# EAGLE design SergeVCO (EAGLE 9.6.2)
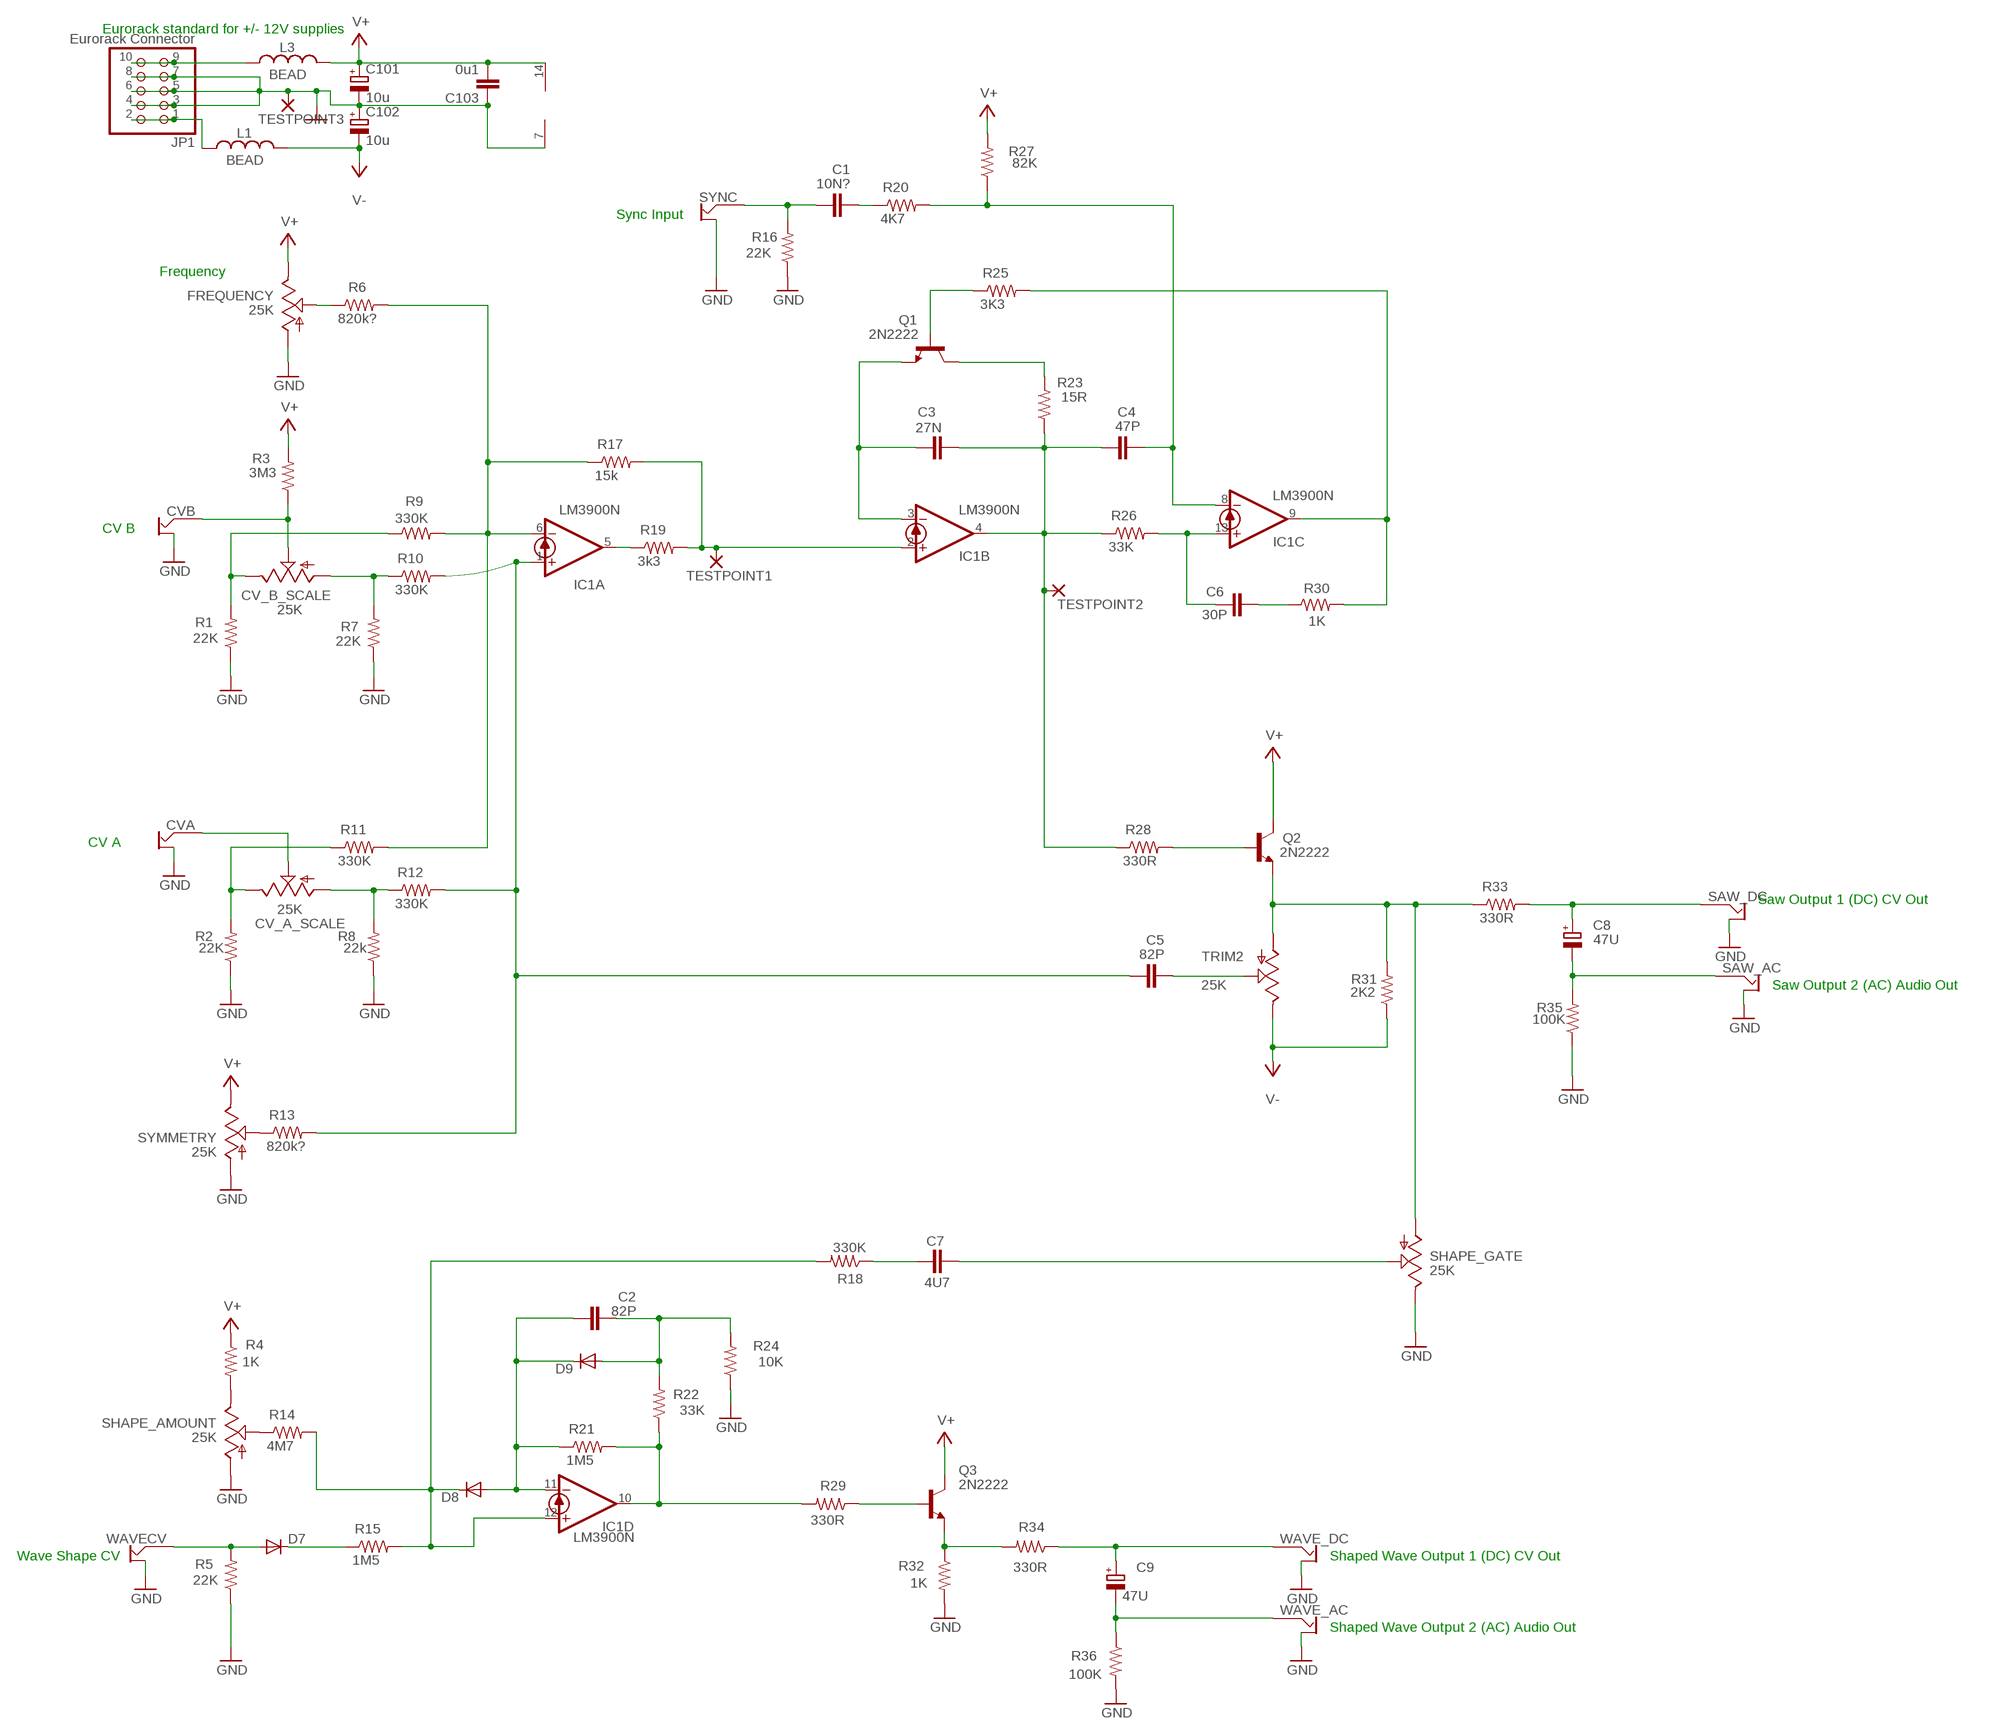
[diagram p0: schematic, sheet 1]

## Parts
C1  10N?  C-EU050-025X075-AARON  [C050-025X075-AARON]
C2  82P  C-EU050-025X075-AARON  [C050-025X075-AARON]
C3  27N  C-EU050-025X075-AARON  [C050-025X075-AARON]
C4  47P  C-EU050-025X075-AARON  [C050-025X075-AARON]
C5  82P  C-EU050-025X075-AARON  [C050-025X075-AARON]
C6  30P  C-EU050-025X075-AARON  [C050-025X075-AARON]
C7  4U7  C-EU050-025X075-AARON  [C050-025X075-AARON]
C8  47U  CPOL-EUE1.8-4  [E1,8-4]
C9  47U  CPOL-EUE1.8-4  [E1,8-4]
C101  10u  CPOL-EUE1.8-4  [E1,8-4]
C102  10u  CPOL-EUE1.8-4  [E1,8-4]
C103  0u1  C-EU050-025X075-AARON  [C050-025X075-AARON]
CV_A_SCALE  25K  TRIM_US-B64Y  [B64Y]
CV_B_SCALE  25K  TRIM_US-B64Y  [B64Y]
CVA  OFFBOARD2JACKALT_AARON  [OFFBOARD2JACKALT]
CVB  OFFBOARD2JACKALT_AARON  [OFFBOARD2JACKALT]
D7  SMALL_DIODEDO35-7  [DO35-7]
D8  SMALL_DIODEDO35-7  [DO35-7]
D9  SMALL_DIODEDO35-7  [DO35-7]
FREQUENCY  25K  TRIM_US-B64Y  [B64Y]
IC1  LM3900N  [DIL14]
JP1  Eurorack Connector  PINHD-2X5  [2X05]
L1  BEAD  L-US0207/10  [0207/10]
L3  BEAD  L-US0207/10  [0207/10]
Q1  2N2222  [TO92-EBC-OVAL]
Q2  2N2222  [TO92-EBC-OVAL]
Q3  2N2222  [TO92-EBC-OVAL]
R1  22K  R-US_0207/10  [0207/10]
R2  22K  R-US_0207/10  [0207/10]
R3  3M3  R-US_0207/10  [0207/10]
R4  1K  R-US_0207/10  [0207/10]
R5  22K  R-US_0207/10  [0207/10]
R6  820k?  R-US_0207/10  [0207/10]
R7  22K  R-US_0207/10  [0207/10]
R8  22k  R-US_0207/10  [0207/10]
R9  330K  R-US_0207/10  [0207/10]
R10  330K  R-US_0207/10  [0207/10]
R11  330K  R-US_0207/10  [0207/10]
R12  330K  R-US_0207/10  [0207/10]
R13  820k?  R-US_0207/10  [0207/10]
R14  4M7  R-US_0207/10  [0207/10]
R15  1M5  R-US_0207/10  [0207/10]
R16  22K  R-US_0207/10  [0207/10]
R17  15k  R-US_0207/10  [0207/10]
R18  330K  R-US_0207/10  [0207/10]
R19  3k3  R-US_0207/10  [0207/10]
R20  4K7  R-US_0207/10  [0207/10]
R21  1M5  R-US_0207/10  [0207/10]
R22  33K  R-US_0207/10  [0207/10]
R23  15R  R-US_0207/10  [0207/10]
R24  10K  R-US_0207/10  [0207/10]
R25  3K3  R-US_0207/10  [0207/10]
R26  33K  R-US_0207/10  [0207/10]
R27  82K  R-US_0207/10  [0207/10]
R28  330R  R-US_0207/10  [0207/10]
R29  330R  R-US_0207/10  [0207/10]
R30  1K  R-US_0207/10  [0207/10]
R31  2K2  R-US_0207/10  [0207/10]
R32  1K  R-US_0207/10  [0207/10]
R33  330R  R-US_0207/10  [0207/10]
R34  330R  R-US_0207/10  [0207/10]
R35  100K  R-US_0207/10  [0207/10]
R36  100K  R-US_0207/10  [0207/10]
SAW_AC  OFFBOARD2JACKALT_AARON  [OFFBOARD2JACKALT]
SAW_DC  OFFBOARD2JACKALT_AARON  [OFFBOARD2JACKALT]
SHAPE_AMOUNT  25K  TRIM_US-B64Y  [B64Y]
SHAPE_GATE  25K  TRIM_US-B64Y  [B64Y]
SYMMETRY  25K  TRIM_US-B64Y  [B64Y]
SYNC  OFFBOARD2JACKALT_AARON  [OFFBOARD2JACKALT]
TESTPOINT1  IOPAD_AARON  [ELLIPTICALPADSINGLE]
TESTPOINT2  IOPAD_AARON  [ELLIPTICALPADSINGLE]
TESTPOINT3  IOPAD_AARON  [ELLIPTICALPADSINGLE]
TRIM2  25K  TRIM_US-RS3  [RS3]
WAVE_AC  OFFBOARD2JACKALT_AARON  [OFFBOARD2JACKALT]
WAVE_DC  OFFBOARD2JACKALT_AARON  [OFFBOARD2JACKALT]
WAVECV  OFFBOARD2JACKALT_AARON  [OFFBOARD2JACKALT]

## Nets
GND: C101.- C102.+ C103.1 CVA.GND CVB.GND FREQUENCY.A IC1.7(P:GND) JP1.3 JP1.4 JP1.5 JP1.6 JP1.7 JP1.8 R1.1 R2.1 R5.1 R7.1 R8.1 R16.1 R24.1 R32.2 R35.1 R36.2 SAW_AC.GND SAW_DC.GND SHAPE_AMOUNT.A SHAPE_GATE.E SYMMETRY.A SYNC.GND TESTPOINT3.P$1(P) WAVE_AC.GND WAVE_DC.GND WAVECV.GND
N$1: FREQUENCY.S R6.1
N$2: CV_B_SCALE.S CVB.SIGNAL R3.1
N$3: CV_B_SCALE.E R1.2 R9.1
N$4: CV_B_SCALE.A R7.2 R10.1
N$5: R13.1 SYMMETRY.S
N$6: R4.2 SHAPE_AMOUNT.E
N$7: R14.1 SHAPE_AMOUNT.S
N$8: D7.A R5.2 WAVECV.SIGNAL
N$9: D7.C R15.1
N$10: CV_A_SCALE.S CVA.SIGNAL
N$11: CV_A_SCALE.E R2.2 R11.1
N$12: CV_A_SCALE.A R8.2 R12.1
N$13: C5.1 IC1.1(A:+IN) R10.2 R12.2 R13.2
N$14: IC1.6(A:-IN) R6.2 R9.2 R11.2 R17.1
N$15: C3.1 IC1.3(B:-IN) Q1.E
N$16: C2.1 D8.A D9.C IC1.11(D:-IN) R21.1
N$17: D8.C IC1.12(D:+IN) R14.2 R15.2 R18.2
N$18: IC1.10(D:OUT) R21.2 R22.1 R29.2
N$19: C2.2 D9.A R22.2 R24.2
N$20: C7.1 R18.1
N$21: C7.2 SHAPE_GATE.S
N$22: Q3.B R29.1
N$23: Q3.E R32.1 R34.2
N$24: C9.- R36.1 WAVE_AC.SIGNAL
N$25: C9.+ R34.1 WAVE_DC.SIGNAL
N$26: IC1.2(B:+IN) R17.2 R19.2 TESTPOINT1.P$1(P)
N$27: IC1.5(A:OUT) R19.1
N$28: C1.1 R16.2 SYNC.SIGNAL
N$29: C3.2 C4.1 IC1.4(B:OUT) R23.1 R26.1 R28.1 TESTPOINT2.P$1(P)
N$30: C1.2 R20.1
N$31: Q1.C R23.2
N$32: Q1.B R25.1
N$33: C6.1 IC1.13(C:+IN) R26.2
N$34: Q2.B R28.2
N$35: C4.2 IC1.8(C:-IN) R20.2 R27.1
N$36: C6.2 R30.1
N$37: IC1.9(C:OUT) R25.2 R30.2
N$38: C8.+ R33.2 SAW_DC.SIGNAL
N$39: Q2.E R31.2 R33.1 SHAPE_GATE.A TRIM2.A
N$40: C5.2 TRIM2.S
N$41: C8.- R35.2 SAW_AC.SIGNAL
N$42: JP1.1 JP1.2 L1.1
N$62: JP1.9 JP1.10 L3.1
V+: C101.+ C103.2 FREQUENCY.E IC1.14(P:V+) L3.2 Q2.C Q3.C R3.2 R4.1 R27.2 SYMMETRY.E
V-: C102.- L1.2 R31.1 TRIM2.E

## Notes on the sheet
- Eurorack standard for +/- 12V supplies
- Sync Input
- Frequency
- CV B
- CV A
- Saw Output 1 (DC) CV Out
- Saw Output 2 (AC) Audio Out
- Wave Shape CV | Shaped Wave Output 1 (DC) CV Out
- Shaped Wave Output 2 (AC) Audio Out

## Library data of the parts
C1-C7 C103 = aaroncaps:C-EU: CAPACITOR, European symbol
C8 C9 C101 C102 = rcl:CPOL-EU: POLARIZED CAPACITOR, European symbol
CV_A_SCALE CV_B_SCALE FREQUENCY SHAPE_AMOUNT SHAPE_GATE SYMMETRY TRIM2 = pot:TRIM_US-: POTENTIOMETER
CVA CVB SAW_AC SAW_DC SYNC WAVE_AC WAVE_DC WAVECV = aaronlibrary:OFFBOARD2JACKALT_AARON
D7-D9 = MusicThingModular:SMALL_DIODE: Small Signal Diode
IC1 = linear:LM3900: OP AMP
JP1 = pinhead:PINHD-2X5: PIN HEADER
L1 L3 = rcl:L-US: INDUCTOR, American symbol; SPICEPREFIX: L
Q1-Q3 = adafruit:2N2222: NPN TRANSISTOR Big oval pads
R1-R36 = rcl:R-US_: RESISTOR, American symbol
TESTPOINT1-TESTPOINT3 = aaronlibrary:IOPAD_AARON

## Board
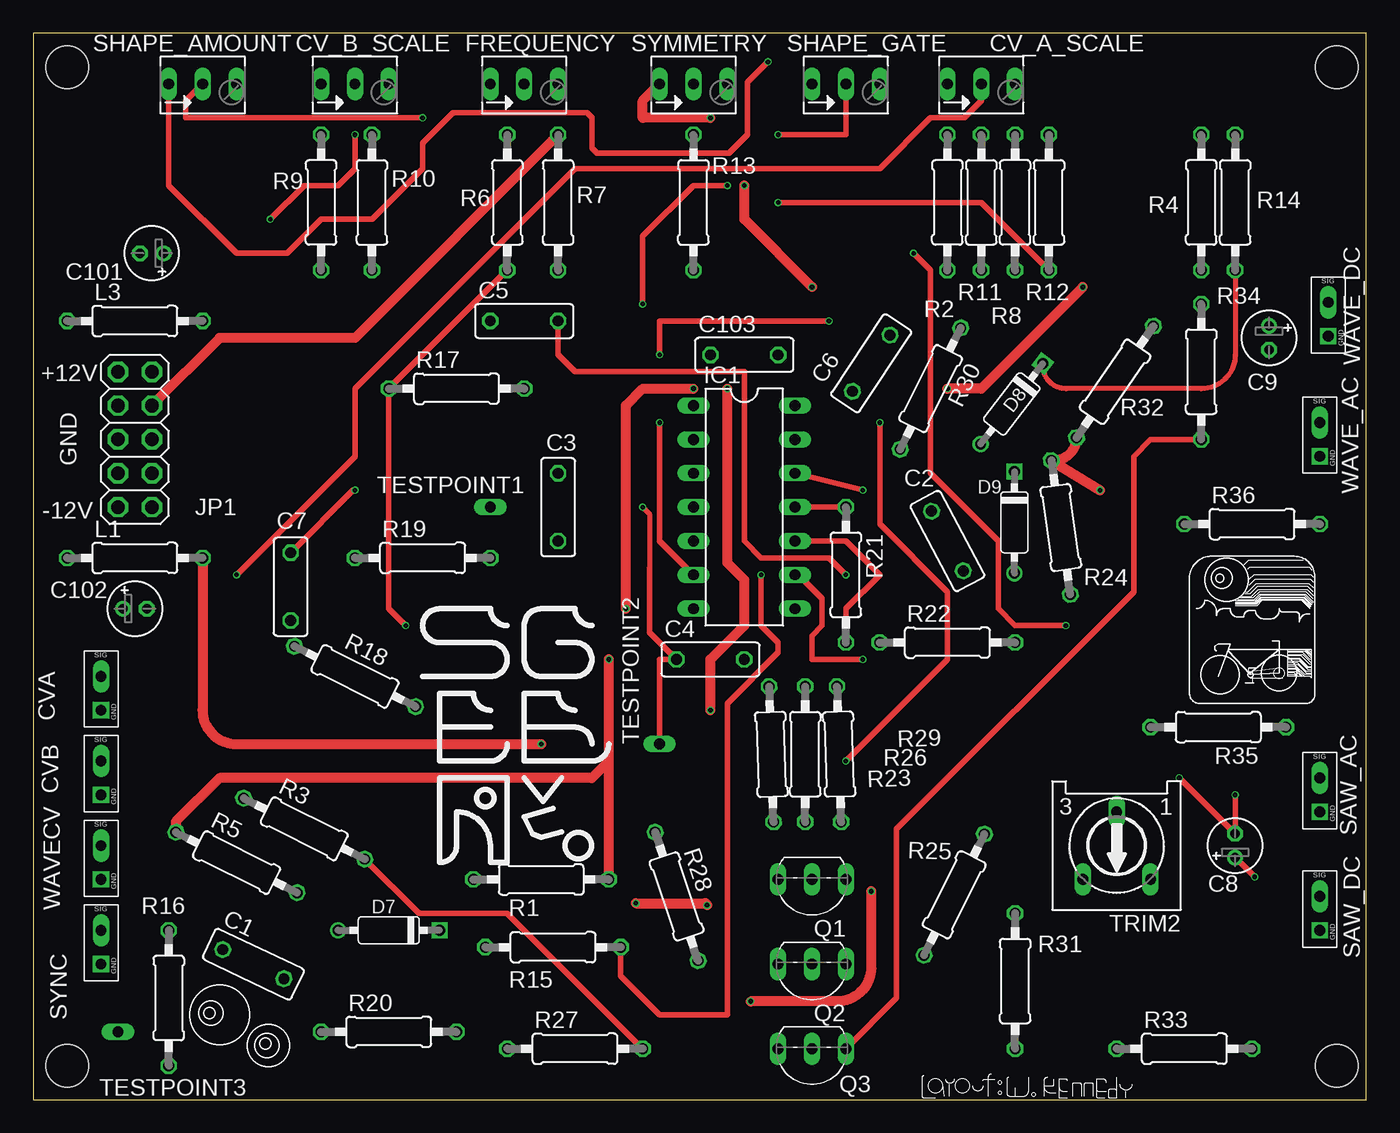
[diagram p1: board, top side]
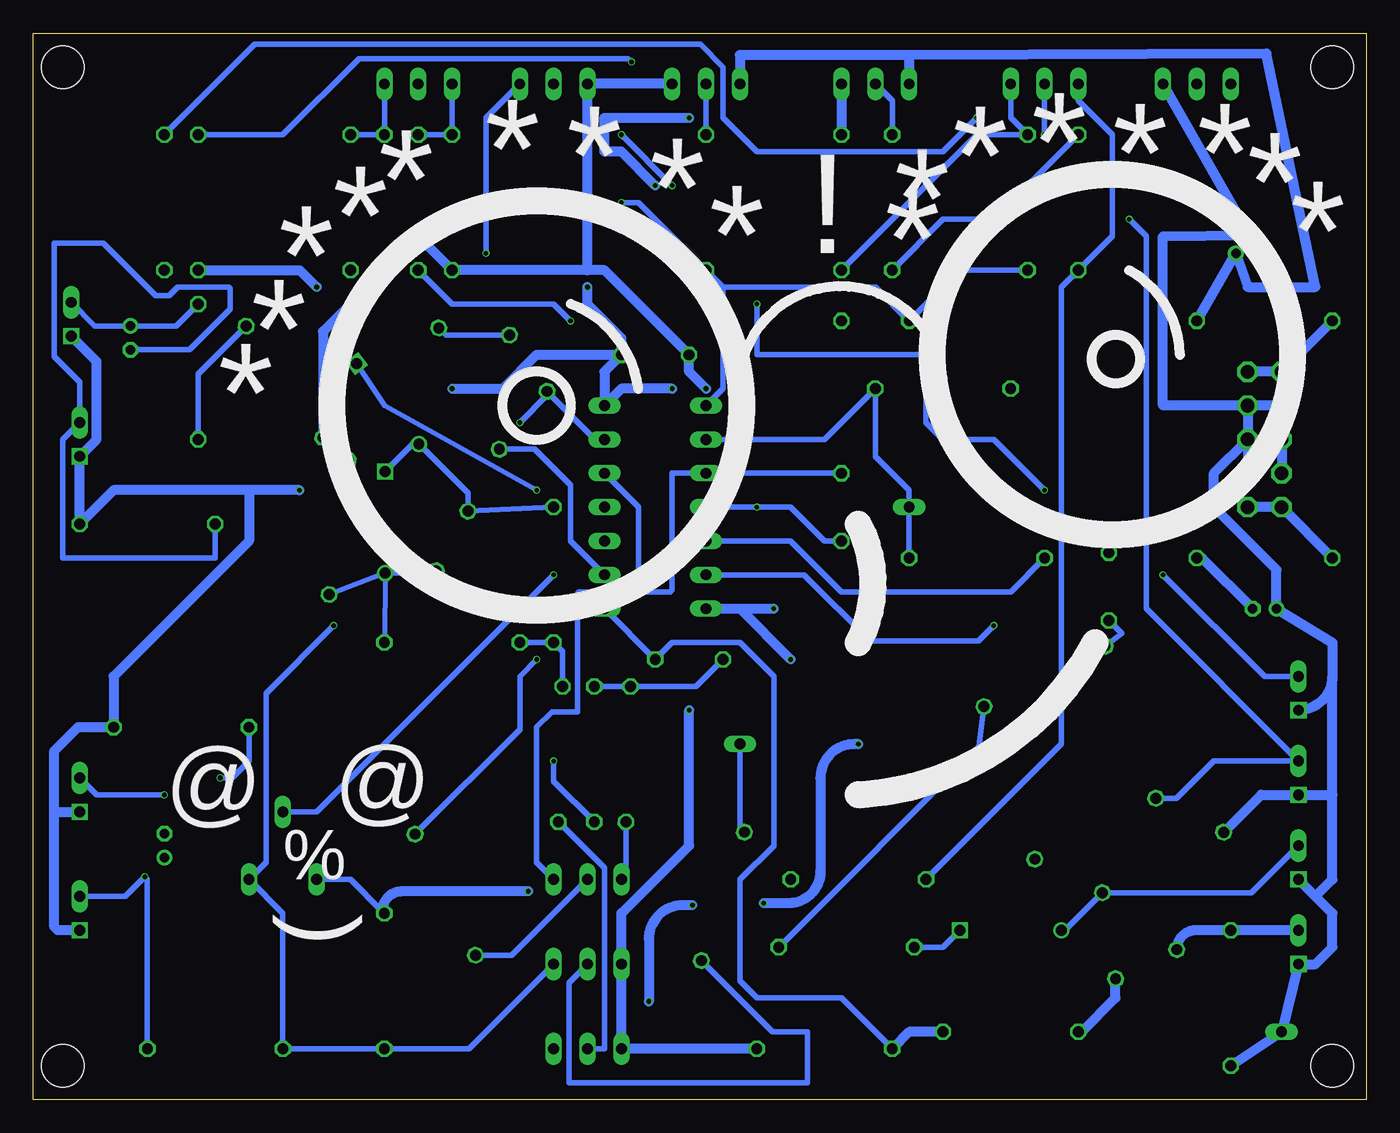
[diagram p2: board, bottom side, seen from below]

Size 100 x 80 mm. Coordinates in mm from the lower left corner, seen from the top.
Outline: 0,0 100,0 100,80 0,80 0,0
Copper layers (1*16): Top 0.035559375mm / dielectric 1.6mm / Bottom 0.035559375mm
Design rules "jlcpcb2layer (1) *": minimum track width 5mil, minimum drill 12mil, track to track 10mil, track to pad 10mil, pad to pad 10mil, via to via 10mil, smd to smd 5mil, copper to edge 8mil, drill to drill 6mil, minimum pad ring 5mil, minimum via ring 3mil, stop-mask expansion 2.5mil, vias tented up to drill 0mil, thermal gap 10mil
Holes 3.2 mm at 2.54,77.47 97.79,77.47 97.79,2.54 2.54,2.54

### Footprints (pad centres in the part's own frame; a part is rotated, then mirrored left to right if it is on the bottom)
C050-025X075-AARON = drill 0.813 octagon: 1 -2.54,0; 2 2.54,0
E1,8-4 = drill 0.711 pad 1.168: + -0.889,0 | drill 0.711 pad 1.168 octagon: - 0.889,0
B64Y = drill 0.813 long: A 2.54,0; E -2.54,0; S 0,0
OFFBOARD2JACKALT = drill 0.813 square: GND -1.27,-1.27 | drill 0.813 long: SIGNAL -1.27,1.27
DO35-7 = drill 0.813: A 3.81,0 | drill 0.813 square: C -3.81,0
DIL14 = drill 0.813 long: 1 -7.62,-3.81; 2 -5.08,-3.81; 3 -2.54,-3.81; 4 0,-3.81; 5 2.54,-3.81; 6 5.08,-3.81; 7 7.62,-3.81; 8 7.62,3.81; 9 5.08,3.81; 10 2.54,3.81; 11 0,3.81; 12 -2.54,3.81; 13 -5.08,3.81; 14 -7.62,3.81
2X05 = drill 1.016 octagon: 1 -5.08,-1.27; 2 -5.08,1.27; 3 -2.54,-1.27; 4 -2.54,1.27; 5 0,-1.27; 6 0,1.27; 7 2.54,-1.27; 8 2.54,1.27; 9 5.08,-1.27; 10 5.08,1.27
0207/10 = drill 0.813 octagon: 1 -5.08,0; 2 5.08,0
TO92-EBC-OVAL = drill 0.813 long: B 0,-1.27; C 2.54,-1.27; E -2.54,-1.27
ELLIPTICALPADSINGLE = drill 0.813 long: P$1 0,0
RS3 = drill 0.813 long: A -2.54,2.54; E 2.54,2.54; S 0,-2.54

### Placement (x,y rotation side)
C1  16.51,10.16 334.5 top
C2  68.58,41.91 298 top
C3  39.37,44.45 270 top
C4  50.8,33.02 0 top
C5  36.83,58.42 0 top
C6  62.87,55.24 56.3 top
C7  19.3,38.48 90 top
C8  90.17,19.05 90 top
C9  92.71,57.15 270 top
C101  8.89,63.5 180 top
C102  7.62,36.83 0 top
C103  53.34,55.88 0 top
CV_A_SCALE  71.12,76.2 0 top
CV_B_SCALE  24.13,76.2 0 top
CVA  6.35,30.48 0 top
CVB  6.35,24.13 0 top
D7  26.67,12.7 180 top
D8  73.41,52.2 232.2 top
D9  73.61,43.31 270 top
FREQUENCY  36.83,76.2 0 top
IC1  53.34,44.45 270 top
JP1  7.62,49.53 90 top
L1  7.62,40.64 0 top
L3  7.62,58.42 0 top
Q1  58.42,15.24 180 top
Q2  58.42,8.89 180 top
Q3  58.42,2.54 180 top
R1  38.1,16.51 180 top
R2  68.58,67.31 90 top
R3  20.32,20.32 333.3 top
R4  87.63,67.31 90 top
R5  15.24,17.78 333.5 top
R6  35.56,67.31 270 top
R7  39.37,67.31 270 top
R8  73.66,67.31 90 top
R9  21.59,67.31 90 top
R10  25.4,67.31 270 top
R11  71.12,67.31 270 top
R12  76.2,67.31 270 top
R13  49.53,67.31 270 top
R14  90.17,67.31 270 top
R15  38.99,11.43 0 top
R16  10.16,7.62 90 top
R17  31.75,53.34 0 top
R18  24.13,31.75 333.5 top
R19  29.21,40.64 0 top
R20  26.67,5.08 0 top
R21  60.96,39.37 270 top
R22  68.58,34.29 0 top
R23  55.37,25.91 271.9 top
R24  77.09,42.93 278 top
R25  69.09,15.37 63.5 top
R26  57.91,25.91 270 top
R27  40.64,3.81 0 top
R28  48.26,15.24 288.5 top
R29  60.45,25.91 91.8 top
R30  67.31,53.34 243.5 top
R31  73.66,8.89 270 top
R32  81.15,53.85 235.4 top
R33  86.36,3.81 0 top
R34  87.63,54.61 270 top
R35  88.9,27.94 180 top
R36  91.44,43.18 0 top
SAW_AC  97.79,22.86 0 top
SAW_DC  97.79,13.97 0 top
SHAPE_AMOUNT  12.7,76.2 0 top
SHAPE_GATE  60.96,76.2 0 top
SYMMETRY  49.53,76.2 0 top
SYNC  6.35,11.43 0 top
TESTPOINT1  34.29,44.45 0 top
TESTPOINT2  46.99,26.67 0 top
TESTPOINT3  6.35,5.08 0 top
TRIM2  81.28,19.05 180 top
WAVE_AC  97.79,49.53 0 top
WAVE_DC  98.42,58.55 0 top
WAVECV  6.35,17.78 0 top

### Tracks (layer width: path | path; a pad name or v marks a point on that pad's centre or on a via)
GND  (via drill 0.35)
  Top 0.762: v80.03,45.72 R24.1 76.56,47.96 arc90 R32.2 | R1.1 43.18,25.4 | 43.18,25.4 v43.18,33.02 | 43.18,25.4 41.91,24.13 13.97,24.13 10.69,20.85 R5.1 | v44.45,36.83 44.45,52.07 45.72,53.34 v49.53,53.34 | R7.1 24.13,57.15 13.97,57.15 JP1.7
  Bottom 0.762: C101.- 8.77,64.84 | 8.77,64.84 SHAPE_AMOUNT.A | JP1.7 JP1.5 | JP1.5 JP1.3 | JP1.7 JP1.8 JP1.4 JP1.6 | 2.54,31.75 2.54,34.29 C102.+ 6.73,39.75 11.43,44.45 11.43,46.99 JP1.5 | 2.54,31.75 arc90 CVA.GND | R5.1 7.88,22.86 CVB.GND 2.54,22.86 | R16.1 TESTPOINT3.P$1 SYNC.GND 3.81,10.16 2.54,11.43 2.54,13.97 3.81,15.24 | JP1.7 15.24,52.07 15.24,64.77 8.77,64.84 | FREQUENCY.A R7.1 | SYMMETRY.A SHAPE_GATE.E 58.42,62.23 | R32.2 78.27,57.62 R8.1 71.12,64.77 R2.1 58.42,62.23 | v80.03,45.72 83.82,45.72 | 83.82,45.72 93.98,45.72 R36.2 WAVE_AC.GND 95.25,49.53 95.25,55.37 WAVE_DC.GND | 58.42,62.23 57.15,62.23 C103.1 50.8,54.61 v49.53,53.34 | SAW_DC.GND 98.17,12.7 98.42,12.95 98.42,21.46 | 98.42,21.46 98.3,21.59 SAW_AC.GND | 98.42,21.46 98.42,26.16 96.65,27.94 R35.1 93.98,31.75 83.82,41.91 83.82,45.72 | v43.18,33.02 46.99,36.83 | IC1.7 46.99,36.83 | 3.81,15.24 WAVECV.GND | 3.81,15.24 2.54,16.51 2.54,22.86 | 2.54,22.86 2.54,31.75 | 46.99,36.83 v44.45,36.83
N$1
  Bottom 0.406: R6.1 35.56,74.93 FREQUENCY.S
N$2  (via drill 0.35)
  Top 0.406: v17.78,66.04 20.32,68.58 22.86,68.58 24.13,69.85 v24.13,72.39
  Bottom 0.406: R3.1 14.23,22.6 11.43,25.4 CVB.SIGNAL 16.51,36.83 16.51,64.77 v17.78,66.04 | v24.13,72.39 CV_B_SCALE.S
N$3
  Bottom 0.406: CV_B_SCALE.E 21.59,74.93 19.05,72.39 19.05,64.77 R9.1 22.86,60.96 22.86,26.67 R1.2
N$4
  Bottom 0.406: CV_B_SCALE.A 26.67,73.66 R10.1 29.21,72.39 R7.2
N$5
  Bottom 0.406: R13.1 SYMMETRY.S
N$6  (via drill 0.35)
  Top 0.406: v55.12,77.85 53.59,76.33 53.59,72.39 52.2,70.99 42.29,70.99 41.91,71.37 41.91,73.66 41.53,74.04 31.5,74.04 29.21,71.75 29.21,69.85 25.4,66.04 21.59,66.04 19.05,63.5 15.24,63.5 10.16,68.58 SHAPE_AMOUNT.E
  Bottom 0.406: R4.2 81.28,72.39 75.56,78.11 55.37,78.11 v55.12,77.85
N$7  (via drill 0.35)
  Top 0.406: v29.21,73.66 11.43,73.66 11.43,74.93 SHAPE_AMOUNT.S
  Bottom 0.406: R14.1 83.39,79.17 49.96,79.17 48.26,77.47 48.26,73.66 45.72,71.12 31.75,71.12 v29.21,73.66
N$8
  Bottom 0.406: D7.A 22.6,12.7 R5.2 8.62,15.51 WAVECV.SIGNAL
N$9
  Bottom 0.406: D7.C 31.75,11.43 R15.1
N$10  (via drill 0.35)
  Top 0.406: v15.24,39.37 24.13,48.26 24.13,53.34 40.64,69.85 63.5,69.85 67.31,73.66 69.85,73.66 71.12,74.93 CV_A_SCALE.S
  Bottom 0.406: v15.24,39.37 7.62,31.75 CVA.SIGNAL
N$11
  Bottom 0.406: CV_A_SCALE.E R2.2 R11.1
N$12
  Bottom 0.406: CV_A_SCALE.A R8.2 R12.1
N$13  (via drill 0.35)
  Top 0.406: v55.88,67.31 71.12,67.31 R12.2
  Bottom 0.406: R10.2 30.48,62.23 C5.1 36.83,60.96 48.26,60.96 | IC1.1 48.26,53.34 48.26,60.96 | 48.26,60.96 R13.2 54.61,67.31 v55.88,67.31
N$14  (via drill 0.35)
  Top 0.406: v27.94,35.56 26.67,36.83 R17.1 R6.2 | v59.69,58.42 46.99,58.42 v46.99,55.88 | v46.99,50.8 46.99,41.91 IC1.6
  Bottom 0.406: R9.2 27.94,66.04 31.75,66.04 R6.2 | R11.2 68.58,59.69 60.96,59.69 v59.69,58.42 | v27.94,35.56 29.08,34.42 37.21,34.42 42.16,39.37 IC1.6 | v46.99,55.88 v46.99,50.8
N$15
  Bottom 0.406: C3.1 IC1.3 52.07,46.99 52.07,38.23 52.2,38.1 59.05,38.1 59.18,37.97 59.18,29.08 61.09,29.08 62.23,27.94 62.23,17.78 Q1.E
N$16
  Top 0.406: R21.1 IC1.11
  Bottom 0.406: D9.C 71.54,49.19 D8.A 67.39,45.5 C2.1 R21.1
N$17  (via drill 0.35)
  Top 0.381: R14.2 90.17,55.88 arc-90 87.63,53.34 77.47,53.34 arc-90 75.74,55.07 D8.C
  Top 0.406: v62.23,45.72 IC1.12 | v54.61,39.37 54.61,35.56 55.88,34.29 55.88,33.53 52.07,29.72 52.07,6.35 46.99,6.35 44.07,9.27 R15.2
  Bottom 0.406: D8.C 73.66,52.07 v62.23,45.72 | IC1.12 54.61,44.45 v54.61,39.37 | R15.2 29.04,26.46 R18.2
N$18
  Top 0.406: R21.2 60.96,36.83 63.5,39.37 60.96,41.91 IC1.10
  Bottom 0.406: R29.2 60.29,33.62 R21.2 R22.1
N$19
  Bottom 0.381: R24.2 D9.A R22.2
  Bottom 0.406: D9.A 69.94,39.5 C2.2
N$20
  Bottom 0.406: C7.1 18.32,34.96 R18.1
N$21  (via drill 0.35)
  Top 0.406: C7.2 24,45.72 v24.13,45.72 | v45.72,59.69 45.72,64.77 49.53,68.58 v52.07,68.58 | v55.88,72.39 60.96,72.39 SHAPE_GATE.S
  Bottom 0.406: v24.13,45.72 27.94,49.53 31.75,49.53 33.02,50.8 33.02,55.88 45.72,55.88 v45.72,59.69 | v52.07,68.58 v55.88,72.39
N$22
  Bottom 0.406: R29.1 57.15,17.37 57.15,3.81 Q3.B
N$23
  Top 0.406: Q3.E 64.77,7.62 64.77,20.32 82.55,38.1 82.55,48.26 83.82,49.53 R34.2
  Bottom 0.406: R32.1 87.63,54.44 R34.2
N$24
  Bottom 0.406: C9.- 88.27,56.26 85.22,59.31 85.22,60.83 85.34,60.96 89.15,60.96 89.79,60.33 90.81,60.33 94.74,64.26 98.42,64.26 98.42,55.75 96.52,53.85 WAVE_AC.SIGNAL 97.79,49.53 97.79,40.64 86.36,40.64 R36.1
N$25
  Bottom 0.406: WAVE_DC.SIGNAL 95.38,58.04 C9.+ 89.28,58.04 R34.1
N$26
  Bottom 0.406: R19.2 TESTPOINT1.P$1 34.29,45.72 36.83,48.26 R17.2 40.64,49.53 IC1.2
N$27
  Bottom 0.406: R19.1 26.67,38.1 39.37,38.1 43.18,41.91 IC1.5
N$28
  Bottom 0.762: SYNC.SIGNAL R16.2 12.77,12.7 arc-90 C1.1
N$29  (via drill 0.35)
  Top 0.381: v45.72,44.45 46.23,43.94 46.23,39.88
  Top 0.406: 46.23,39.88 46.23,35.05 C4.1 46.99,33.02 TESTPOINT2.P$1
  Bottom 0.406: C3.2 40.64,41.91 43.18,44.45 v45.72,44.45 IC1.4 | R26.1 R23.1 50.3,30.98 C4.1 | TESTPOINT2.P$1 46.99,20.4 R28.1
N$30
  Bottom 0.762: C1.2 18.8,7.62 21.34,5.08 R20.1
N$31
  Bottom 0.406: R23.2 55.54,16.85 Q1.C
N$32
  Bottom 0.406: R25.1 64.11,10.82 Q1.B
N$33  (via drill 0.35)
  Top 0.406: v60.96,25.4 68.58,33.02 68.58,38.1 63.5,43.18 v63.5,50.8
  Bottom 0.406: IC1.13 57.85,49.53 C6.1 61.46,52.84 v63.5,50.8 | R26.2 60.96,23.88 v60.96,25.4
N$34
  Bottom 0.406: R28.2 44.53,5.08 41.91,5.08 41.91,1.27 59.82,1.27 59.82,8.76 Q2.B
N$35
  Bottom 0.406: IC1.8 C4.2 52.07,34.29 46.99,34.29 44.45,31.75 44.45,19.05 46.99,16.51 46.99,8.89 45.72,7.62 39.37,7.62 R27.1
  Bottom 0.762: R20.2 34.29,5.08 R27.1
N$36
  Bottom 0.406: R30.1 69.05,57.36 C6.2
N$37  (via drill 0.35)
  Top 0.406: v62.23,33.02 58.42,33.02 58.42,34.8 59.18,35.56 59.18,37.59 57.4,39.37 IC1.9
  Bottom 0.406: IC1.9 59.69,41.91 59.69,46.1 62.38,48.79 R30.2 | R25.2 63.5,27.77 63.5,31.75 v62.23,33.02
N$38  (via drill 0.35)
  Top 0.406: C8.+ v91.63,16.7
  Bottom 0.406: SAW_DC.SIGNAL 93.09,15.24 v91.63,16.7 91.44,16.51 R33.2
N$39  (via drill 0.35)
  Top 0.406: v66.04,63.5 67.31,62.23 67.31,46.99 72.39,41.91 72.39,36.83 73.66,35.56 v77.47,35.56
  Bottom 0.406: Q2.E 67.31,3.81 R31.2 R33.1 81.28,13.97 TRIM2.A 82.55,17.78 82.55,30.48 v77.47,35.56 | SHAPE_GATE.A 66.04,73.66 v66.04,63.5
N$40  (via drill 0.35)
  Top 0.406: v60.96,39.37 59.69,40.64 54.61,40.64 53.34,41.91 53.34,54.61 40.64,54.61 39.37,55.88 C5.2
  Bottom 0.406: TRIM2.S 78.74,21.59 v60.96,39.37
N$41  (via drill 0.35)
  Top 0.406: v90.17,22.86 C8.- v85.98,24.13
  Bottom 0.406: SAW_AC.SIGNAL 95.25,22.86 v90.17,22.86 | v85.98,24.13 85.09,24.13 83.82,25.4 R35.2
N$42
  Bottom 0.762: JP1.1 JP1.2 L1.1
N$62
  Bottom 0.762: L3.1 JP1.10 JP1.9
V+  (via drill 0.35)
  Top 0.406: R27.2 35.56,13.97 28.93,13.97 R3.2
  Top 0.762: v50.8,29.21 50.8,33.02 53.34,35.56 53.34,38.99 52.07,40.26 v52.07,53.34 | v78.74,60.96 71.12,53.34 v68.58,53.34 | v58.42,60.96 53.34,66.04 v53.34,68.58 | v50.8,73.66 45.72,73.66 45.72,74.93 SYMMETRY.E
  Bottom 0.762: L3.2 C101.+ 8.89,60.96 3.81,60.96 7.49,78.49 34.29,78.36 | R27.2 Q3.C Q2.C 55.88,13.97 50.8,19.05 v50.8,29.21 | 34.29,78.36 FREQUENCY.E | 34.29,78.36 46.99,78.36 SYMMETRY.E | C103.2 57.15,54.61 IC1.14 55.88,53.34 v52.07,53.34 | R4.1 80.01,62.23 v78.74,60.96 | v68.58,53.34 64.77,53.34 62.23,55.88 C103.2 | C103.2 55.88,57.15 58.42,59.69 v58.42,60.96 | v53.34,68.58 55.88,71.12 57.15,71.12 57.15,73.66 v50.8,73.66
V-  (via drill 0.35)
  Top 0.762: L1.2 12.7,29.21 arc90 15.24,26.67 v38.1,26.67 | v45.21,14.73 50.39,14.73 arc-90 v50.55,14.58 | v62.87,15.62 62.87,9.91 arc-90 60.33,7.37 v53.82,7.37
  Bottom 0.406: R31.1 73.83,14.13 76.2,16.51 TRIM2.E
  Bottom 0.762: L1.2 12.32,40.64 C102.- | v38.1,26.67 38.41,26.67 arc-90 40.95,24.13 40.95,17.12 arc90 43.33,14.73 v45.21,14.73 | v50.55,14.58 51.28,14.58 arc-90 53.82,12.04 v53.82,7.37 | v62.87,15.62 72.34,15.62 arc-90 73.83,14.13

### Text on the board
tPlace: +12V | GND | -12V
bPlace: * | * | * | * | * | * | * | * | * | * | ! | * | * | * | * | * | * | * | @ | @ | % | (